# Altium schematic sheet Input.SchDoc
size A4
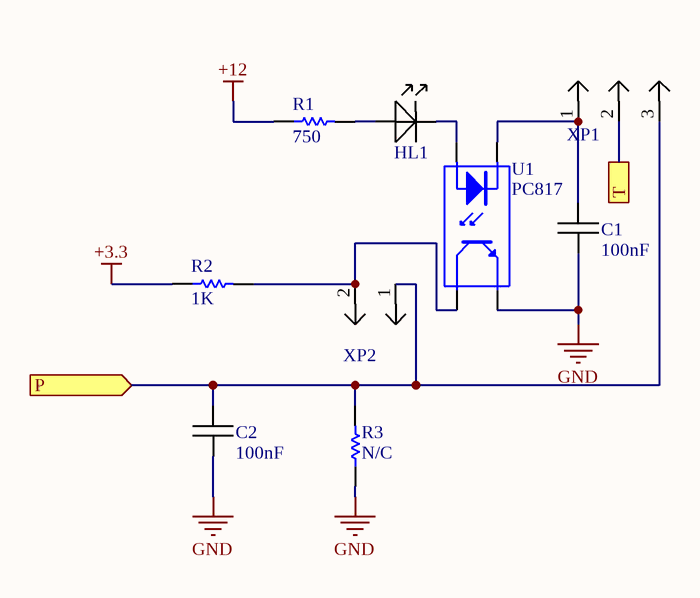
[diagram p0: Input.SchDoc]

## Parts
C1  Val: 100nF  [CAP0805]  (hidden comment: CAP_SMD)
C2  Val: 100nF  [CAP0805]  (hidden comment: CAP_SMD)
HL1  LED_SMD  [0805_LED]  (value not drawn)
R1  Val: 750  [RES0805]  (hidden comment: RES_SMD)
R2  Val: 1K  [RES0805]  (hidden comment: RES_SMD)
R3  Val: N/C  [RES0805]  (hidden comment: RES_SMD)
U1  PC817  [DIP-4 - SMT]
XP1  PLS-03  [PLS-03]  (value not drawn)
XP2  PLS-02  [PLS-02]  (value not drawn)

## Ports
P (in), T

## Nets
+3.3: R2.1
+12: R1.1
GND: C1.1 C2.1 R3.1 U1.3(E)
P: C2.2 R3.2 XP1.3 XP2.1 ; port P
T: XP1.2 ; port T
NetC1_2: C1.2 U1.2(K) XP1.1
NetHL1_1: HL1.1(anode) R1.2
NetHL1_2: HL1.2(cathode) U1.1(A)
NetR2_2: R2.2 U1.4(C) XP2.2

## Library data of the parts
C1 C2 = CAP_SMD: Ceramic capacitor, 0805
HL1 = LED_SMD: 0805 led
U1 = PC817: 4-Pin Phototransistor Optocoupler; Published: 24-Mar-1999; LatestRevisionDate: 04-Mar-2005; LatestRevisionNote: Sch pins 3 & 4 Swapped.; DatasheetVersion: Nov-2003; PackageReference: DIP-4; Publisher: Altium Limited